# Altium schematic sheet USB-RS485_mini.SchDoc
size 594 x 420 mm; ApprovedBy: Лазарев В.П.; SheetTotal: 1; PageSetup: Record=PageOptions|CenterHorizontal=True|CenterVertical=True|PrintScale=1.00|XCorrection=1.00|YCorrection=1.00|PrintKind=0|BorderSize=5000000|LeftOffset=0|BottomOffset=0|Orientation=2|PaperLength=1000|PaperWidth=1000|Scale=100|PaperSource=260|PrintQuality=600|MediaType=1|DitherType=10|PaperKind=A3|PrintScaleMode=0
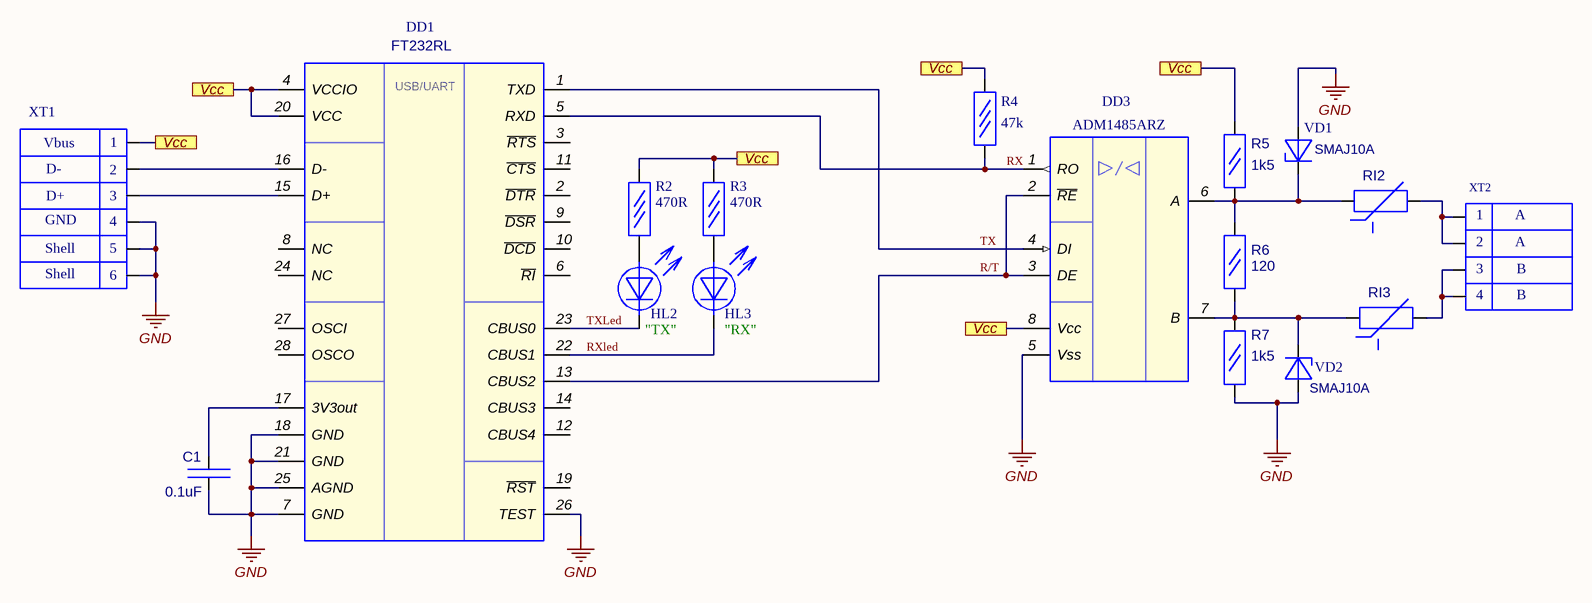
[diagram p0: USB-RS485_mini.SchDoc]

## Parts
C1  value 0.1uF  [1608[0603]]  (hidden comment: Cap1)
DD1  FT232RL  [SSOP28]
DD3  value ADM1485ARZ  [SO8_M]  (hidden comment: MAX48xx)
HL2  LED1_Gost_2  [LED_R- 0603]  (value not drawn)
HL3  LED1_Gost_2  [LED_Y- 0603]  (value not drawn)
R2  value 470R  [RESC1608(0603)]  (hidden comment: Res 1/16W)
R3  value 470R  [RESC1608(0603)]  (hidden comment: Res 1/16W)
R4  value 47k  [RESC1608(0603)]  (hidden comment: Res 1/16W)
R5  value 1k5  [RESC2012(0805)]  (hidden comment: Res 1/8W)
R6  value 120  [RESC2012(0805)]  (hidden comment: Res 1/8W)
R7  value 1k5  [RESC2012(0805)]  (hidden comment: Res 1/8W)
RI2  MF-MSMF010  [Fuse 1206]  (value not drawn)
RI3  MF-MSMF010  [Fuse 1206]  (value not drawn)
VD1  value SMAJ10A  [SMA (DO-214AC)]  (hidden comment: Diode Zener)
VD2  value SMAJ10A  [SMA (DO-214AC)]  (hidden comment: Diode Zener)
XT1  Connect x6  [USB-AR]  (value not drawn)
XT2  Connect x4_mini  [Term. Block-4pin]  (value not drawn)

## Ports
Vcc

## Nets
GND: C1.1 DD1.7(GND) DD1.18(GND) DD1.21(GND) DD1.25(AGND) DD1.26(TEST) DD3.5(Vss) R7.2 VD1.1 VD2.1 XT1.4 XT1.5 XT1.6
R/T: DD1.13(CBUS2) DD3.2(~{RE}) DD3.3(DE)
RX: DD1.5(RXD) DD3.1(RO) R4.1
RXled: DD1.22(CBUS1) HL3.2
TX: DD1.1(TXD) DD3.4(DI)
TXLed: DD1.23(CBUS0) HL2.2
Vcc: DD1.4(VCCIO) DD1.20(VCC) DD3.8(Vcc) R2.2 R3.2 R4.2 R5.1 XT1.1 ; port Vcc
NetC1_2: C1.2 DD1.17(3V3out)
NetDD1_15: DD1.15(D+) XT1.3
NetDD1_16: DD1.16(D-) XT1.2
NetDD3_6: DD3.6(A) R5.2 R6.2 RI2.2 VD1.2
NetDD3_7: DD3.7(B) R6.1 R7.1 RI3.2 VD2.2
NetHL2_1: HL2.1 R2.1
NetHL3_1: HL3.1 R3.1
NetRI2_1: RI2.1 XT2.1(A) XT2.2(A)
NetRI3_1: RI3.1 XT2.3(B) XT2.4(B)

Not connected (* = marked no-connect by the designer): DD1 2(~{DTR}) 3(~{RTS}) 6(~{RI}) 8(NC) 9(~{DSR}) 10(~{DCD}) 11(~{CTS}) 12(CBUS4) 14(CBUS3) 19(~{RST}) 24(NC) 27(OSCI) 28(OSCO)

## Notes on the sheet
- (near HL2) "TX"
- (near HL3) "RX"
- Подп. дата
- Инв. № дубл.
- Взам. инв. №
- Подп. и дата
- Изм.
- Лист.
- № докум.
- Подп.
- Дата
- Лит.
- Масса
- Масштаб
- Разраб.
- Пров.
- Т. контр.
- Лист 1
- Листов
- 1:1
- Инв. № подп.
- Н. контр.
- Утв.
- Формат А2
- (in symbol Connect x6) Vbus; D-; D+; GND; Shell

## Library data of the parts
C1 = Cap1: Capacitor GOST; Voltage: 25V; Function: CVCC; Dielectric: Y5V; Tolerance: 5%/10%; PackageDescription: Chip Capasitor; Package Reference: C0603
DD1 = FT232RL: USB/UART; Function: USB/UART converter; Package: *; Value: FT232RL
DD3 = MAX48xx: MAX483EESA; Function: RS485 Transceiver; PackageReference: SO-8
HL2 = LED1_Gost_2: Nichia157 LED; Value: BL-LS0603URC; Color: Red; PackageDescription: LED SMD_0603; 2 Flat Leads
HL3 = LED1_Gost_2: Nichia157 LED; Value: BL-LS0603UYC; Color: Yellow; PackageDescription: LED SMD_0603; 2 Flat Leads
R2-R4 = Res 1/16W: CR0603 GOST; PackageDescription: Chip 0603; PackageReference: RC0603; Part Number: *
R5-R7 = Res 1/8W: Resistor GOST; Tolerance: 10%; PackageDescription: Chip Resistor, Body 2.0x1.3mm,; PackageReference: *; Part Number: *
RI2 RI3 = MF-MSMF010: MultiFuse; Value: MF-MSMF110; Current hold: 110 mA; Function: MultiFuse; Package: SMD 1206
VD1 VD2 = Diode Zener: Diode Zener GOST; Function: TVS Diode; Part Number: *; PackageReference: *; PackageDescription: SMA/DO-214AC
XT1 = Connect x6: USB
XT2 = Connect x4_mini: 2xRS485